# EAGLE design V60_Roco_69377_Lichtplatine_V2 (EAGLE 5.10)
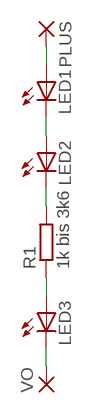
[diagram p0: schematic, sheet 1]

## Parts
LED1  LEDCHIPLED_0603-JP  [CHIPLED-0603-JP]
LED2  LEDCHIPLED_0603-JP  [CHIPLED-0603-JP]
LED3  LEDCHIPLED_0603-JP  [CHIPLED-0603-JP]
PLUS  SMD-LONG1,27-1,9  [SMD1,27-1,9]
R1  1k bis 3k6  R-EU_R0603S  [R0603S]
VO  SMD-LONG1,27-1,9  [SMD1,27-1,9]

## Nets
N$1: LED2.C R1.2
N$2: LED3.A R1.1
N$3: LED3.C VO.1(P)
N$5: LED1.A PLUS.1(P)
N$19: LED1.C LED2.A

## Library data of the parts
LED1-LED3 = led:LED: LED OSRAM: - CHIPLED LG R971, LG N971, LY N971, LG Q971, LY Q971, LO R971, LY R971 LH N974, LH R974 LS Q976, LO Q976, LY Q976 LO Q996 - Hyper CHIPLED LW Q18S LB Q993, LB Q99A, LB R99A - SideLED LS A670, LO A670, LY A670, LG A670, LP A670 LB A673, LV A673, LT A673, LW A673 LH A674 LY A675 LS A676, LA A676, LO A676, LY A676, LW A676 LS A679, LY A679, LG A679 - Hyper Micro SIDELED® LS Y876, LA Y876, LO Y876, LY Y876 LT Y87S - SmartLED LW L88C, LW L88S LB L89C, LB L89S, LG L890 LS L89K, LO L89K, LY L89K LS L896, LA L896, LO L896, LY L896 - TOPLED LS T670, LO T670, LY T670, LG T670, LP T670 LSG T670, LSP T670, LSY T670, LOP T670, LYG T670 LG T671, LOG T671, LSG T671 LB T673, LV T673, LT T673, LW T673 LH T674 LS T676, LA T676, LO T676, LY T676, LB T676, LH T676, LSB T676, LW T676 LB T67C, LV T67C, LT T67C, LS T67K, LO T67K, LY T67K, LW E67C LS E67B, LA E67B, LO E67B, LY E67B, LB E67C, LV E67C, LT E67C LW T67C LS T679, LY T679, LG T679 LS T770, LO T770, LY T770, LG T770, LP T770 LB T773, LV T773, LT T773, LW T773 LH T774 LS E675, LA E675, LY E675, LS T675 LS T776, LA T776, LO T776, LY T776, LB T776 LHGB T686 LT T68C, LB T68C - Hyper Mini TOPLED® LB M676 - Mini TOPLED Santana® LG M470 LS M47K, LO M47K, LY M47K Source: http://www.osram.convergy.de LUXEON: - LUMILED® LXK2-PW12-R00, LXK2-PW12-S00, LXK2-PW14-U00, LXK2-PW14-V00 LXK2-PM12-R00, LXK2-PM12-S00, LXK2-PM14-U00 LXK2-PE12-Q00, LXK2-PE12-R00, LXK2-PE12-S00, LXK2-PE14-T00, LXK2-PE14-U00 LXK2-PB12-K00, LXK2-PB12-L00, LXK2-PB12-M00, LXK2-PB14-N00, LXK2-PB14-P00, LXK2-PB14-Q00 LXK2-PR12-L00, LXK2-PR12-M00, LXK2-PR14-Q00, LXK2-PR14-R00 LXK2-PD12-Q00, LXK2-PD12-R00, LXK2-PD12-S00 LXK2-PH12-R00, LXK2-PH12-S00 LXK2-PL12-P00, LXK2-PL12-Q00, LXK2-PL12-R00 Source: www.luxeon.com KINGBRIGHT: KA-3528ASYC Source: www.kingbright.com
PLUS VO = wirepad:SMD-LONG
R1 = rcl:R-EU_: RESISTOR, European symbol

## Board
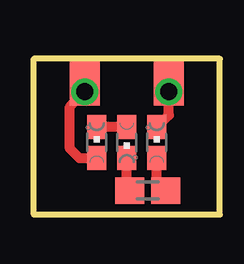
[diagram p1: board, top side]

No outline drawn. Coordinates in mm, seen from the top.
Copper layers (1*16): Top 0.035mm / dielectric 1.5mm / Bottom 0.035mm
Design rules "default *": minimum track width 7mil, minimum drill 0.4mm, track to track 8mil, track to pad 8mil, pad to pad 8mil, via to via 8mil, smd to smd 8mil, copper to edge 40mil, drill to drill 8mil, minimum pad ring 10mil, minimum via ring 8mil, stop-mask expansion 4mil, vias tented up to drill 0mil, thermal gap 10mil
Milling: 4 lines

### Footprints (pad centres in the part's own frame; a part is rotated, then mirrored left to right if it is on the bottom)
CHIPLED-0603-JP = smd 0.8 x 1: A 0,-0.65; C 0,0.65
SMD1,27-1,9 = smd 1.27 x 1.905: 1 0,0
R0603S = smd 1.2 x 1.1: 1 -0.75,0; 2 0.75,0

### Placement (x,y rotation side)
LED1  2.62,3 0 top
LED2  3.88,3 180 top
LED3  5.12,3 0 top
PLUS  2.12,5.5 0 top
R1  4.75,1 180 top
VO  5.62,5.5 0 top

### Tracks (layer width: path | path; a pad name or v marks a point on that pad's centre or on a via)
N$1
  Top 0.406: LED2.C 3.88,1.12 R1.2
N$2
  Top 0.406: LED3.A 5.12,1.38 R1.1
N$3  (via drill 0.7)
  Top 0.406: LED3.C 5.62,4.15 v5.62,5.12 VO.1
N$5  (via drill 0.7)
  Top 0.406: LED1.A 1.9,2.35 1.5,2.75 1.5,4.5 v2.12,5.12 PLUS.1
N$19
  Top 0.406: LED2.A LED1.C

### Text on the board
Measures: Dicke = 1mm